# Altium schematic sheet MAX96724_COUPON.SchDoc
size B; SheetNumber: 1; SheetTotal: 2
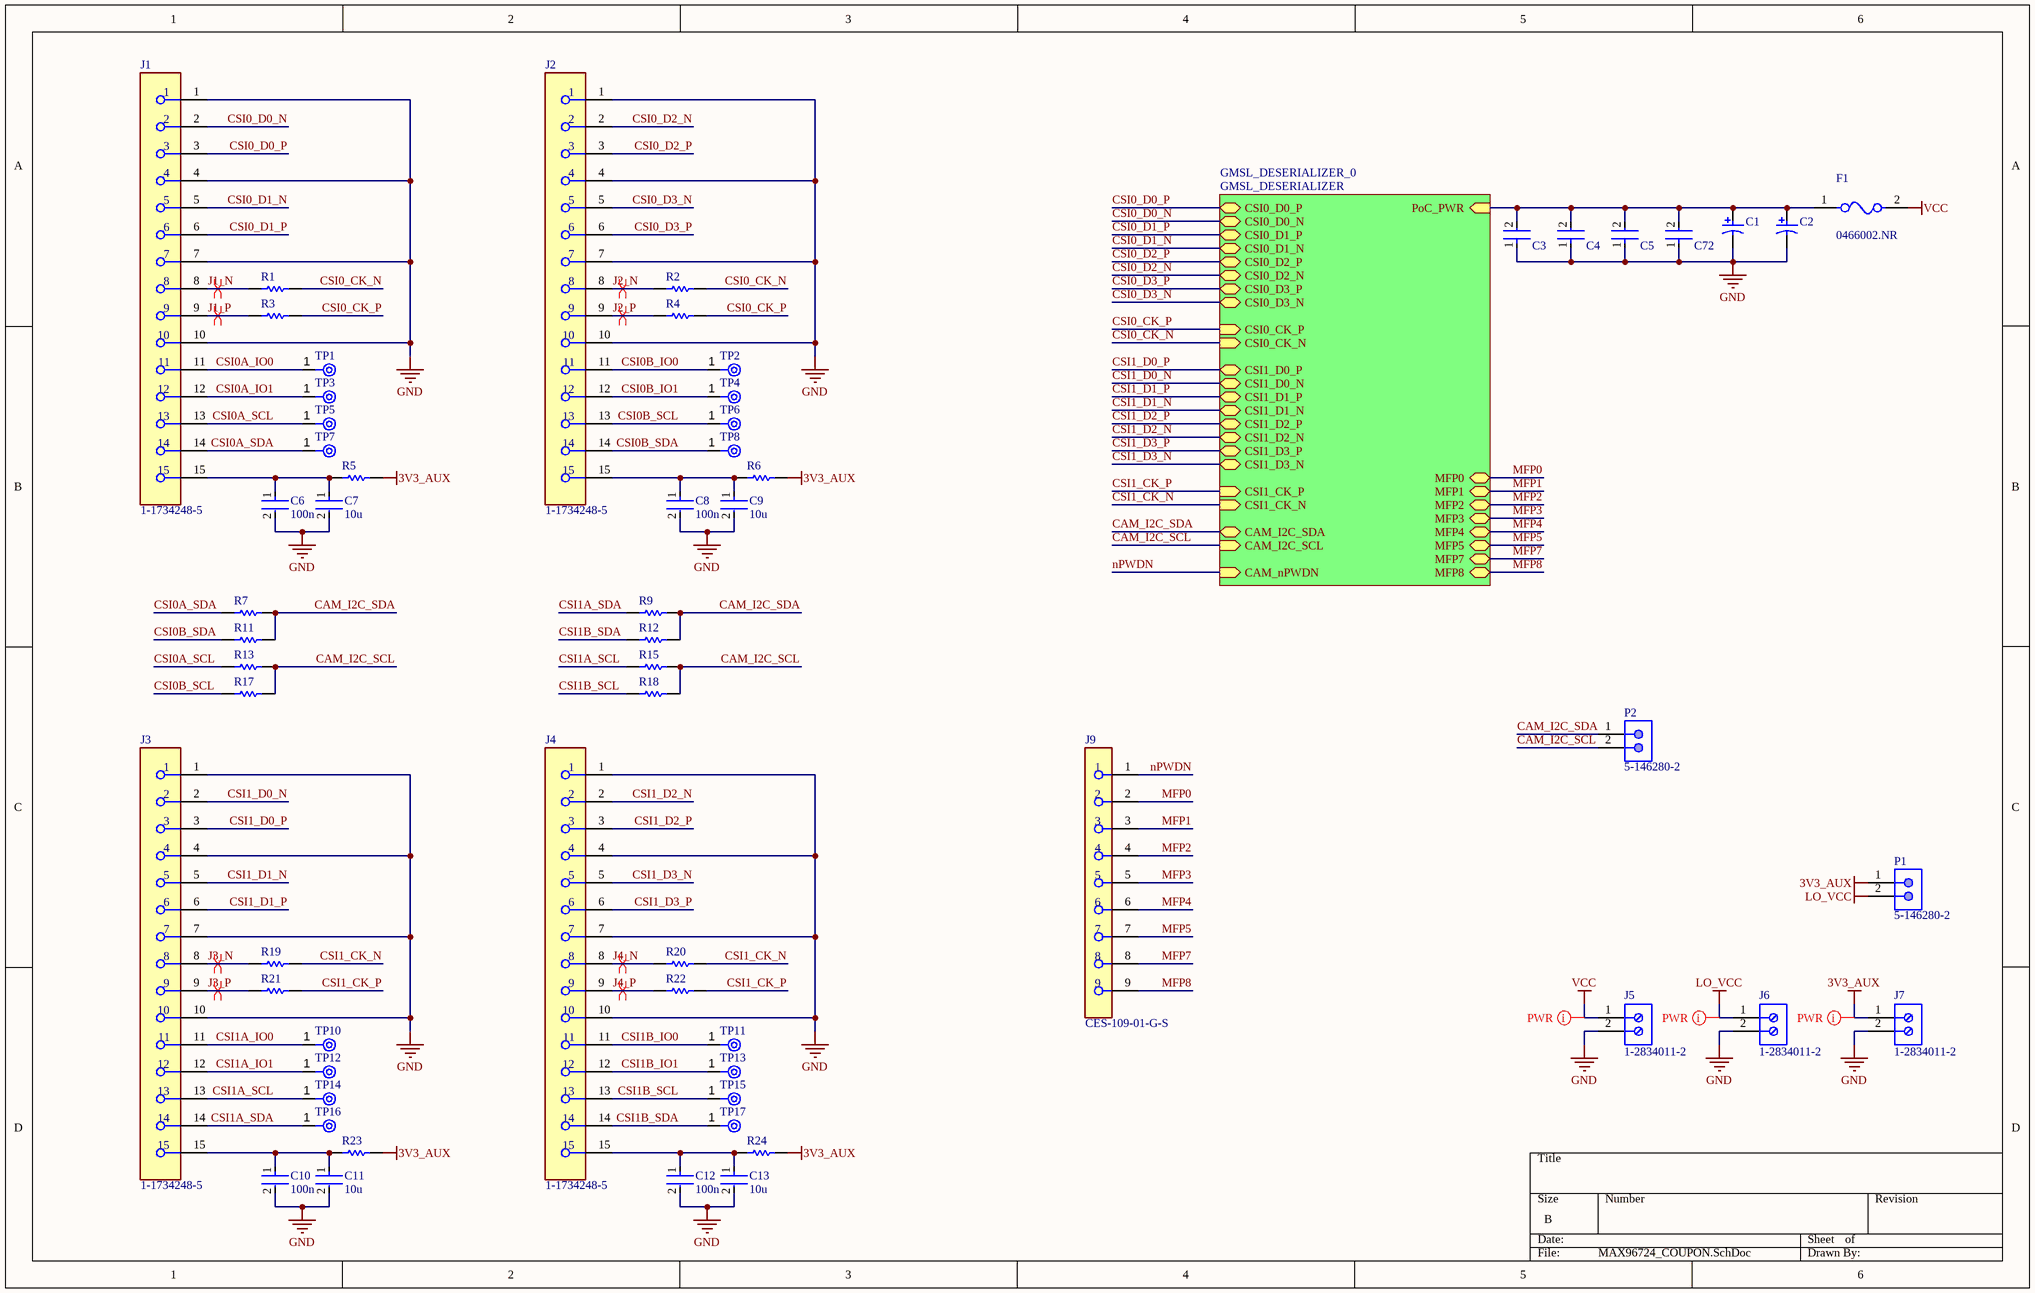
[diagram p0: MAX96724_COUPON.SchDoc]

## Parts
C1  EEEFK1E101XP  [PNSC-FK-V-D8_V]  (value not drawn)
C2  EEEFK1E101XP  [PNSC-FK-V-D8_V]  (value not drawn)
C3  GRM21BR61E226ME44L  [FP-GRM21B-0_2-e0_2_0_7-IPC_B]  (value not drawn)
C4  GRM21BR61E226ME44L  [FP-GRM21B-0_2-e0_2_0_7-IPC_B]  (value not drawn)
C5  GRM21BR61E226ME44L  [FP-GRM21B-0_2-e0_2_0_7-IPC_B]  (value not drawn)
C6  100n  [FP-0402-L_1_0_0_05-W_0_5-IPC_A]
C7  10u  [FP-0402-L_1_0_0_05-W_0_5-IPC_A]
C8  100n  [FP-0402-L_1_0_0_05-W_0_5-IPC_A]
C9  10u  [FP-0402-L_1_0_0_05-W_0_5-IPC_A]
C10  100n  [FP-0402-L_1_0_0_05-W_0_5-IPC_A]
C11  10u  [FP-0402-L_1_0_0_05-W_0_5-IPC_A]
C12  100n  [FP-0402-L_1_0_0_05-W_0_5-IPC_A]
C13  10u  [FP-0402-L_1_0_0_05-W_0_5-IPC_A]
C72  GRM21BR61E226ME44L  [FP-GRM21B-0_2-e0_2_0_7-IPC_B]  (value not drawn)
F1  0466002.NR  [FP-0466-MFG]
J1  1-1734248-5  [FP-1-1734248-5-MFG]
J2  1-1734248-5  [FP-1-1734248-5-MFG]
J3  1-1734248-5  [FP-1-1734248-5-MFG]
J4  1-1734248-5  [FP-1-1734248-5-MFG]
J5  1-2834011-2  [1-2834011-2-Footprint-1]
J6  1-2834011-2  [1-2834011-2-Footprint-1]
J7  1-2834011-2  [1-2834011-2-Footprint-1]
J9  CES-109-01-G-S  [FP-CES-109-01-G-S-MFG]
P1  5-146280-2  [TECO-5-146280-2_V]
P2  5-146280-2  [TECO-5-146280-2_V]
R1  0402 JUMPER  [RESC1005X40X25ML05T05]  (value not drawn)
R2  0402 JUMPER  [RESC1005X40X25ML05T05]  (value not drawn)
R3  0402 JUMPER  [RESC1005X40X25ML05T05]  (value not drawn)
R4  0402 JUMPER  [RESC1005X40X25ML05T05]  (value not drawn)
R5  RC0402JR-070RL  [RESC1005X40X25NL05T10]  (value not drawn)
R6  RC0402JR-070RL  [RESC1005X40X25NL05T10]  (value not drawn)
R7  RC0402JR-070RL  [RESC1005X40X25NL05T10]  (value not drawn)
R9  RC0402JR-070RL  [RESC1005X40X25NL05T10]  (value not drawn)
R11  RC0402JR-070RL  [RESC1005X40X25NL05T10]  (value not drawn)
R12  RC0402JR-070RL  [RESC1005X40X25NL05T10]  (value not drawn)
R13  RC0402JR-070RL  [RESC1005X40X25NL05T10]  (value not drawn)
R15  RC0402JR-070RL  [RESC1005X40X25NL05T10]  (value not drawn)
R17  RC0402JR-070RL  [RESC1005X40X25NL05T10]  (value not drawn)
R18  RC0402JR-070RL  [RESC1005X40X25NL05T10]  (value not drawn)
R19  0402 JUMPER  [RESC1005X40X25ML05T05]  (value not drawn)
R20  0402 JUMPER  [RESC1005X40X25ML05T05]  (value not drawn)
R21  0402 JUMPER  [RESC1005X40X25ML05T05]  (value not drawn)
R22  0402 JUMPER  [RESC1005X40X25ML05T05]  (value not drawn)
R23  RC0402JR-070RL  [RESC1005X40X25NL05T10]  (value not drawn)
R24  RC0402JR-070RL  [RESC1005X40X25NL05T10]  (value not drawn)
TP1  TPAD6R  [New footprint 1]  (value not drawn)
TP2  TPAD6R  [New footprint 1]  (value not drawn)
TP3  TPAD6R  [New footprint 1]  (value not drawn)
TP4  TPAD6R  [New footprint 1]  (value not drawn)
TP5  TPAD6R  [New footprint 1]  (value not drawn)
TP6  TPAD6R  [New footprint 1]  (value not drawn)
TP7  TPAD6R  [New footprint 1]  (value not drawn)
TP8  TPAD6R  [New footprint 1]  (value not drawn)
TP10  TPAD6R  [New footprint 1]  (value not drawn)
TP11  TPAD6R  [New footprint 1]  (value not drawn)
TP12  TPAD6R  [New footprint 1]  (value not drawn)
TP13  TPAD6R  [New footprint 1]  (value not drawn)
TP14  TPAD6R  [New footprint 1]  (value not drawn)
TP15  TPAD6R  [New footprint 1]  (value not drawn)
TP16  TPAD6R  [New footprint 1]  (value not drawn)
TP17  TPAD6R  [New footprint 1]  (value not drawn)

## Sub-sheets
GMSL_DESERIALIZER_0 = GMSL_DESERIALIZER: CSI0_D0_P (bidir), CSI0_D0_N (bidir), CSI0_D1_P (bidir), CSI0_D1_N (bidir), CSI0_D2_P (bidir), CSI0_D2_N (bidir), CSI0_D3_P (bidir), CSI0_D3_N (bidir), CSI0_CK_P (in), CSI0_CK_N (in), CSI1_D0_P (bidir), CSI1_D0_N (bidir), CSI1_D1_P (bidir), CSI1_D1_N (bidir), CSI1_D2_P (bidir), CSI1_D2_N (bidir), CSI1_D3_P (bidir), CSI1_D3_N (bidir), CSI1_CK_P (in), CSI1_CK_N (in), CAM_I2C_SDA (bidir), CAM_I2C_SCL (in), CAM_nPWDN (in), PoC_PWR (in), MFP0 (bidir), MFP1 (bidir), MFP2 (bidir), MFP3 (bidir), MFP4 (bidir), MFP5 (bidir), MFP7 (bidir), MFP8 (bidir)

## Nets
3V3_AUX: J7.1 P1.1 R5.2 R6.2 R23.2 R24.2
GND: C1.2 C2.2 C3.1 C4.1 C5.1 C6.2 C7.2 C8.2 C9.2 C10.2 C11.2 C12.2 C13.2 C72.1 J1.1 J1.4 J1.7 J1.10 J2.1 J2.4 J2.7 J2.10 J3.1 J3.4 J3.7 J3.10 J4.1 J4.4 J4.7 J4.10 J5.2 J6.2 J7.2
LO_VCC: J6.1 P1.2
VCC: F1.2 J5.1
CAM_I2C_SCL: P2.2 R13.2 R15.2 R17.2 R18.2 ; sheet GMSL_DESERIALIZER_0/CAM_I2C_SCL
CAM_I2C_SDA: P2.1 R7.2 R9.2 R11.2 R12.2 ; sheet GMSL_DESERIALIZER_0/CAM_I2C_SDA
CSI0_CK_N: R1.2 R2.2 ; sheet GMSL_DESERIALIZER_0/CSI0_CK_N
CSI0_CK_P: R3.2 R4.2 ; sheet GMSL_DESERIALIZER_0/CSI0_CK_P
CSI0_D0_N: J1.2 ; sheet GMSL_DESERIALIZER_0/CSI0_D0_N
CSI0_D0_P: J1.3 ; sheet GMSL_DESERIALIZER_0/CSI0_D0_P
CSI0_D1_N: J1.5 ; sheet GMSL_DESERIALIZER_0/CSI0_D1_N
CSI0_D1_P: J1.6 ; sheet GMSL_DESERIALIZER_0/CSI0_D1_P
CSI0_D2_N: J2.2 ; sheet GMSL_DESERIALIZER_0/CSI0_D2_N
CSI0_D2_P: J2.3 ; sheet GMSL_DESERIALIZER_0/CSI0_D2_P
CSI0_D3_N: J2.5 ; sheet GMSL_DESERIALIZER_0/CSI0_D3_N
CSI0_D3_P: J2.6 ; sheet GMSL_DESERIALIZER_0/CSI0_D3_P
CSI0A_IO0: J1.11 TP1.1(TP)
CSI0A_IO1: J1.12 TP3.1(TP)
CSI0A_SCL: J1.13 R13.1 TP5.1(TP)
CSI0A_SDA: J1.14 R7.1 TP7.1(TP)
CSI0B_IO0: J2.11 TP2.1(TP)
CSI0B_IO1: J2.12 TP4.1(TP)
CSI0B_SCL: J2.13 R17.1 TP6.1(TP)
CSI0B_SDA: J2.14 R11.1 TP8.1(TP)
CSI1_CK_N: R19.2 R20.2 ; sheet GMSL_DESERIALIZER_0/CSI1_CK_N
CSI1_CK_P: R21.2 R22.2 ; sheet GMSL_DESERIALIZER_0/CSI1_CK_P
CSI1_D0_N: J3.2 ; sheet GMSL_DESERIALIZER_0/CSI1_D0_N
CSI1_D0_P: J3.3 ; sheet GMSL_DESERIALIZER_0/CSI1_D0_P
CSI1_D1_N: J3.5 ; sheet GMSL_DESERIALIZER_0/CSI1_D1_N
CSI1_D1_P: J3.6 ; sheet GMSL_DESERIALIZER_0/CSI1_D1_P
CSI1_D2_N: J4.2 ; sheet GMSL_DESERIALIZER_0/CSI1_D2_N
CSI1_D2_P: J4.3 ; sheet GMSL_DESERIALIZER_0/CSI1_D2_P
CSI1_D3_N: J4.5 ; sheet GMSL_DESERIALIZER_0/CSI1_D3_N
CSI1_D3_P: J4.6 ; sheet GMSL_DESERIALIZER_0/CSI1_D3_P
CSI1A_IO0: J3.11 TP10.1(TP)
CSI1A_IO1: J3.12 TP12.1(TP)
CSI1A_SCL: J3.13 R15.1 TP14.1(TP)
CSI1A_SDA: J3.14 R9.1 TP16.1(TP)
CSI1B_IO0: J4.11 TP11.1(TP)
CSI1B_IO1: J4.12 TP13.1(TP)
CSI1B_SCL: J4.13 R18.1 TP15.1(TP)
CSI1B_SDA: J4.14 R12.1 TP17.1(TP)
J1_N: J1.8 R1.1
J1_P: J1.9 R3.1
J2_N: J2.8 R2.1
J2_P: J2.9 R4.1
J3_N: J3.8 R19.1
J3_P: J3.9 R21.1
J4_N: J4.8 R20.1
J4_P: J4.9 R22.1
MFP0: J9.2 ; sheet GMSL_DESERIALIZER_0/MFP0
MFP1: J9.3 ; sheet GMSL_DESERIALIZER_0/MFP1
MFP2: J9.4 ; sheet GMSL_DESERIALIZER_0/MFP2
MFP3: J9.5 ; sheet GMSL_DESERIALIZER_0/MFP3
MFP4: J9.6 ; sheet GMSL_DESERIALIZER_0/MFP4
MFP5: J9.7 ; sheet GMSL_DESERIALIZER_0/MFP5
MFP7: J9.8 ; sheet GMSL_DESERIALIZER_0/MFP7
MFP8: J9.9 ; sheet GMSL_DESERIALIZER_0/MFP8
nPWDN: J9.1 ; sheet GMSL_DESERIALIZER_0/CAM_nPWDN
NetC1_1: C1.1 C2.1 C3.2 C4.2 C5.2 C72.2 F1.1 ; sheet GMSL_DESERIALIZER_0/PoC_PWR
NetC6_1: C6.1 C7.1 J1.15 R5.1
NetC8_1: C8.1 C9.1 J2.15 R6.1
NetC10_1: C10.1 C11.1 J3.15 R23.1
NetC12_1: C12.1 C13.1 J4.15 R24.1

## Layout directives
differential pair; differential pair class 100DIFF: J1_N, J1_P, J2_N, J2_P, J3_N, J3_P, J4_N, J4_P
net class PWR: 3V3_AUX, LO_VCC, VCC

## Library data of the parts
C1 C2 = CMP-2000-06206-1: Aluminum Electrolytic Capacitor, 100 uF, +/- 20%, 25 V, 2-Pin SMD (Size Code D8), -55 to 105 degC, RoHS, Tape and Reel; Manufacturer: Panasonic; Type: Can; Lifetime@Temperature: 2000Hrs@105°C; Capacitance: 100µF; Rated Voltage: 25V; Ripple Current: 280mA; Impedance: 0.34O; Case Size/Dimension: Ø6.3x7.7mm; Operating Temp-Max: 105°C; Series: FK; Package URL: http://industrial.panasonic.com/cdbs/www-data/pdf/RDE0000/DME0000COL48.pdf; Mounting Technology: SurfaceMount; Package Description: 2-Pin Electrolytic Aluminum Capacitor, Body 6.6 x 6.6 mm; Datasheet Version: 03/2016; Datasheet URL: http://industrial.panasonic.com/cdbs/www-data/pdf/RDE0000/ABA0000C1181.pdf; Manufacturer URL: http://www.panasonic.com/; Package Reference: FK-V-D8; Operating Temp Range: -55to+105°C
C3-C5 C72 = CMP-2007-03222-3: Chip Multilayer Ceramic Capacitors for General Purpose, 0805, 22uF, X5R, 15%, 20%, 25V; Case/Package: 0805; Depth: 1.25mm; Resistor Type: Ceramic; Voltage Rating: 25V; Lead Free: Lead Free; Voltage Rating (DC): 25V; Case Code (Metric): 2012; Thickness: 0.057inch; REACH SVHC: No SVHC; Material: Ceramic; Tolerance: 20%; Length: 2mm; Capacitance: 22uF; Case Code (Imperial): 0805; Max Operating Temperature: 85°C; Termination: SMD/SMT; Weight: 0.000335oz; Dielectric: X5R; Packaging: Tape and Reel; Voltage: 25V; Package Quantity: 3000; Height: 1.25mm; Mount: Surface Mount; Width: 1.25mm; Min Operating Temperature: -55°C
C6-C13 = CMP-001-00058-1: LARGE PADS, 0402 CAP, CHANGE COMMENT TO MATCH REAL P/N; Capacitor Type: Ceramic; Min Operating Temperature: -55°C; Mounting Technology: Surface Mount; Pins: 2; Case/Package: 0402; RoHS Compliant: Yes; Max Operating Temperature: 85°C
F1 = CMP-2000-05742-2: FUSE BOARD MNT 2A 63VAC/VDC 1206; Manufacturer: Littelfuse; Max Fuse Dc Voltage: 63V; Fuse I2T: 0.2326A2Sec; Fuse Voltage Drop: 78.73mV; Fuse Interrupt Ac Current: 50A; Resistance: 0.03Ω; Value: 0.03Ω; Fuse Blow Speed: Fast; Temperature Range Low: -55°C; Octopart: https://octopart.com/0466002.nr-littelfuse-566006; Category: Fuse; Digikey Description: FUSE BOARD MNT 2A 63VAC/VDC 1206; Height: 0.66mm; Temperature: -55°C to +90°C; ComponentLink2URL: https://www.littelfuse.com/~/media/electronics/datasheets/fuses/littelfuse_fuse_466_datasheet.pdf.pdf; Device Class L3: unset; Device Class L2: Fuses; Device Class L1: Circuit Protection; Lead Free: Yes; Mouser Description: 466 Series Very Fast-Acting 63 V 2 A 1206 Surface Mount Thin Film Fuse; Package: 0466; Fuse Current: 2A; Temperature Range High: +90°C; Voltage Rating: 63V; Manufacturer Part Number: 0466002.NR; Automotive: No; Max Fuse Ac Voltage: 63V; ComponentLink2Description: Datasheet; RoHS: TRUE; Fuse Interrupt Dc Current: 50A
J1-J4 = CMP-03368-000001-1: CONN FPC VERT 15POS 1.00MM SMD; Manufacturer: TE; Conn Orientation: Vertical; Conn Gender: Female; Current Rating: 1A; Is Female: yes; Number Of Contacts: 15; Pitch: 1mm; Voltage Rating: 125V; ComponentLink2URL: https://www.te.com/commerce/DocumentDelivery/DDEController?Action=showdoc&DocId=Customer+Drawing%7F1734248%7FE1%7Fpdf%7FEnglish%7FENG_CD_1734248_E1__.pdf%7F1-1734248-5; Device Class L1: Connectors; Category: Conn; Package: 0; Lead Free: Yes; Digikey Description: CONN FPC VERT 15POS 1.00MM SMD; Height: 8mm; Manufacturer Part Number: 1-1734248-5; Temperature: -20°C to +85°C; Contact Material: Gold,Nickel; Device Class L3: unset; ComponentLink2Description: Datasheet; RoHS: TRUE; Temperature Range Low: -20°C; Octopart: https://octopart.com/1-1734248-5-te+connectivity-40620898; Device Class L2: FFC / FPC; Mouser Description: FFC & FPC Connectors 15P 1.0 FPC, Zip V/T SMT; Automotive: No; Temperature Range High: +85°C; Mounting Type: Surface Mount
J5-J7 = CMP-002-00067-1: Barrier Strip Terminal Block; RoHS Compliant: Yes
J9 = CMP-00575-09340057-1: CES-109-01-G-S Conn Socket Strip SKT 9 POS 2.54mm Solder ST Top Entry Thru-Hole Tube; Manufacturer Lifecycle Status: PRODUCTION; Current Rating: 5.5A; Max Current Rating: 1A; Number of Contacts: 9; Max Voltage Rating (AC): 333V; Voltage Rating: 400V; Gender: Receptacle; Contact Resistance: 10mΩ; Depth: 3.05mm; NexarPartId: 9340057; Contact Plating: Gold; Termination: Solder; Housing Color: Black; REACH SVHC: No SVHC; Contact Material: Bronze, Gold, Nickel; Min Operating Temperature: -55°C; Radiation Hardening: No; Orientation: Straight; Length: 22.86mm; RoHS: Compliant; Housing Material: Polyester; Lifecycle Status: Production; Max Operating Temperature: 125°C; Pitch: 2.54mm; Height: 5.21mm; Number of Rows: 1
P1 P2 = CMP-2000-07492-1: Male Header, Pitch 2.54 mm, 1 x 2 Position, Height 8.21 mm, Tail Length 3.05 mm, -65 to 105 degC, RoHS, Bulk; Manufacturer: TE Connectivity; Mating Connector Lock: No(Without); Number of Positions: 2; Pitch: 2.54mm; PCB Mounting Orientation: Vertical; Keyed: No; Case\/Package: 100; Mating Post Length: 0.23inch; High Temperature Housing: Yes; Max Current Rating: 5A; PCB Thickness: 0.063inch; PCB Mount Retention: Without; Approvals: CSA; Current Rating: 3A; Radiation Hardening: No; Length: 4.67mm; Contact Mating Length: 0.23inch; Connector Type: Header; Number of Rows: 1; Termination Post Length: 0.12inch; Board Standoff: No(Without); Max Operating Temperature: 105degC; Contact Shape: Square; Selectively Loaded: No(Without); Gasket: No(Without); Number of Contacts: 2; Contact Gender: Male; Mating Alignment: No(Without); Manufacturer URL: http://www.te.com/; Datasheet URL: http://www.te.com/commerce/DocumentDelivery/DDEController?Action=showdoc&DocId=Customer+Drawing%7F146280%7FH1%7Fpdf%7FEnglish%7FENG_CD_146280_H1.pdf%7F5-146280-2; Mount: ThroughHole; Orientation: Straight; Packaging: Carton; Package Reference: 5-146280-2; Package Quantity: 500; Stabilizers: No(Without); Row Spacing: 2.54mm; Contact Material: CopperAlloy; Panel Mount Retention: No(Without); Datasheet Version: Rev. H1, 08/2016; Housing Colour: Black; Colour: Black; Package Description: Male Header, Pitch 2.54 mm, 1 x 2 Position, Height 8.21 mm, Tail Length 3.05 mm; Contact Plating: Matte; Housing Material: Polymer; Contact Protection: No(Without); Min Operating Temperature: -65degC; Mounting Technology: ThroughHole; Flammability Rating: UL94V-0; RoHSCompliant: true; Termination: ThroughHole; Depth: 2.34mm; High Speed Serial Data Connector: No
R1-R4 R19-R22 = CMP-009-00118-2: READ THE NAME; Pins: 2; Component Type: Standard; Design Item ID: CMP-009-00206-2; Source: 0402jump.SchLib
R5-R7 R9 R11-R13 R15 R17 R18 R23 R24 = CMP-1011-00001-2: Manufacturer: Yageo / Phycomp; Part Number: RC0402JR-070RL
TP1-TP8 TP10-TP17 = CMP-00025-2: Test Point .6mm